# EasyEDA schematic sch_microcontroller.json
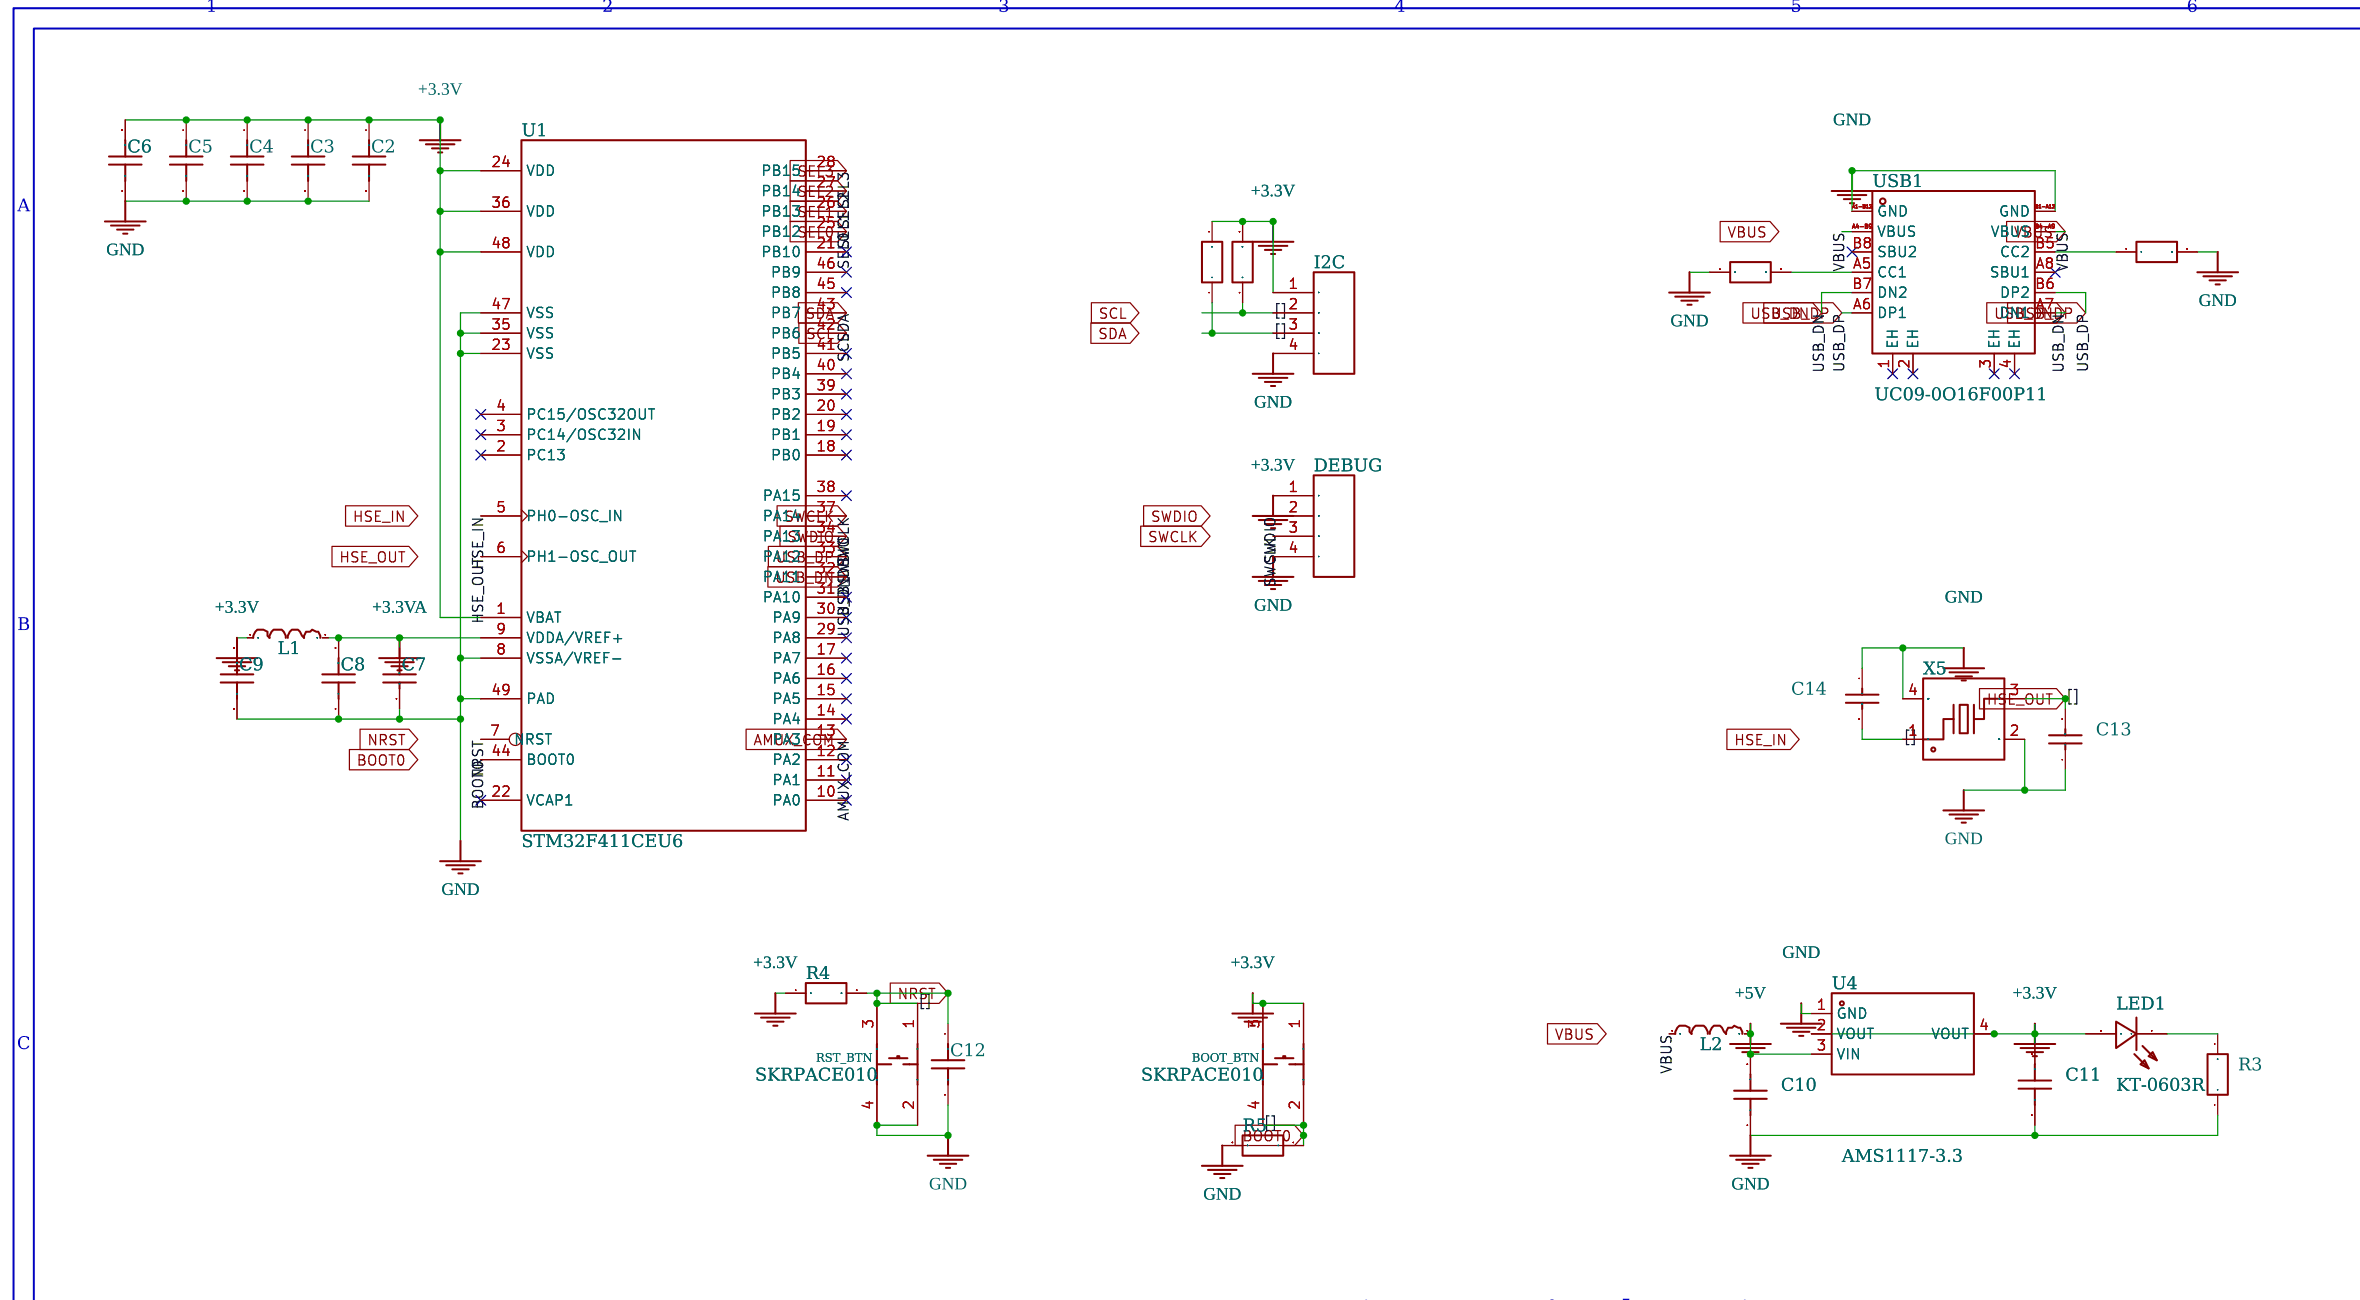
[diagram p0: schematic sheet]

## Parts
BOOT_BTN  SKRPACE010  [KEY-SMD_4P-L4.2-W3.2-P2.20-LS4.6]
C2  100nF  [C0201]
C3  100nF  [C0201]
C4  100nF  [C0201]
C5  100nF  [C0201]
C6  10uF  [C1206]
C7  10nF  [C0402]
C8  1uF  [C0402]
C9  1uF  [C0402]
C10  22uF  [C1206]
C11  22uF  [C1206]
C12  100nF  [C0201]
C13  20pF  [C0402]
C14  20pF  [C0402]
DEBUG  NO  [4 PIN HEADER]
I2C  NO  [4 PIN HEADER]
L1  BLM18AG121SN1D  [L0603]
L2  BLM18AG121SN1D  [L0603]
LED1  KT-0603R  [LED0603-RD]
R1  5.1kΩ  [R0402]
R2  5.1kΩ  [R0402]
R3  5.1kΩ  [R0402]
R4  10kΩ  [R0805]
R5  10kΩ  [R0805]
R6  1.2kΩ  [R0201]
R7  1.2kΩ  [R0201]
RST_BTN  SKRPACE010  [KEY-SMD_4P-L4.2-W3.2-P2.20-LS4.6]
U1  STM32F411CEU6  [UFQFPN-48_L7.0-W7.0-P0.50-BL-EP]
U4  AMS1117-3.3  [SOT-223-3_L6.5-W3.4-P2.30-LS7.0-BR]
USB1  UC09-0O16F00P11  [USB-C-SMD_UC09-0O16F00P11]
X5  25MHz  [CRYSTAL-SMD_4P-L3.2-W2.5-BL]

## Library data of the parts
BOOT_BTN RST_BTN = -: Supplier: LCSC; Manufacturer: ALPSALPINE(阿尔卑斯阿尔派); Supplier Part: C139797; JLCPCB Part Class: Extended Part; LCSC Part Name: 4.2*3.2*2.5mm 立贴 轻触开关; Supplier Footprint: SMD; Datasheet: https://atta.szlcsc.com/upload/public/pdf/source/20171113/C139797_15105612676371115729.pdf; Add into BOM: yes; Convert to PCB: yes; Circuit: SPST; Actuator Style: Oval button; Mounting Style: Brick nogging; Switch Length: 4.2mm; Switch Width: 3.2mm; Switch Height: 2.5mm; Contact Current: 50mA; Voltage Rating (DC): 16V
C2-C5 C12 = -: Symbol: TCC0201X7R104K160ZT; Device: TCC0201X7R104K160ZT; LCSC Part Name: 100nF ±10% 16V; Supplier Part: C18164586; Manufacturer: CCTC(三环); Manufacturer Part: TCC0201X7R104K160ZT; Supplier Footprint: 0201; JLCPCB Part Class: Extended Part; Datasheet: https://atta.szlcsc.com/upload/public/pdf/source/20191203/C466239_F62A586702D44EEA1C39B32FC8662B21.pdf; Supplier: LCSC; Add into BOM: yes; Convert to PCB: yes; Tolerance: ±10%; Voltage Rating: 16V; Temperature Coefficient: X7R
C6 = -: Symbol: HGC1206R7106K350NSPJ; Device: HGC1206R7106K350NSPJ; LCSC Part Name: 10uF ±10% 35V; Supplier Part: C33546014; Manufacturer: Chinocera(华瓷); Manufacturer Part: HGC1206R7106K350NSPJ; Supplier Footprint: 1206; JLCPCB Part Class: Extended Part; Datasheet: https://atta.szlcsc.com/upload/public/pdf/source/20240724/7749F3690BCC21BF5565A9D339ADF00C.pdf; Supplier: LCSC; Add into BOM: yes; Convert to PCB: yes; Tolerance: ±10%; Voltage Rating: 35V; Temperature Coefficient: X7R
C7 = -: Symbol: 0402B103K500NT; Device: 0402B103K500NT; LCSC Part Name: 10nF ±10% 50V; Supplier Part: C1524; Manufacturer: FH(风华); Manufacturer Part: 0402B103K500NT; Supplier Footprint: 0402; JLCPCB Part Class: Extended Part; Datasheet: https://atta.szlcsc.com/upload/public/pdf/source/20200305/C486355_26A10D38EF8C2A5C37091D0039909270.pdf; Supplier: LCSC; Add into BOM: yes; Convert to PCB: yes; Tolerance: ±10%; Voltage Rating: 50V; Temperature Coefficient: X7R
C8 C9 = -: Symbol: TCC0402X5R105K500AT; Device: TCC0402X5R105K500AT; LCSC Part Name: 1uF ±10% 50V; Supplier Part: C20539426; Manufacturer: CCTC(三环); Manufacturer Part: TCC0402X5R105K500AT; Supplier Footprint: 0402; JLCPCB Part Class: Extended Part; Datasheet: https://atta.szlcsc.com/upload/public/pdf/source/20191203/C466239_F62A586702D44EEA1C39B32FC8662B21.pdf; Supplier: LCSC; Add into BOM: yes; Convert to PCB: yes; Tolerance: ±10%; Voltage Rating: 50V; Temperature Coefficient: X5R
C10 C11 = -: Symbol: TCC1206X7R226K160HT; Device: TCC1206X7R226K160HT; LCSC Part Name: 22uF ±10% 16V; Supplier Part: C22392398; Manufacturer: CCTC(三环); Manufacturer Part: TCC1206X7R226K160HT; Supplier Footprint: 1206; JLCPCB Part Class: Extended Part; Datasheet: https://atta.szlcsc.com/upload/public/pdf/source/20191203/C466239_F62A586702D44EEA1C39B32FC8662B21.pdf; Supplier: LCSC; Add into BOM: yes; Convert to PCB: yes; Tolerance: ±10%; Voltage Rating: 16V; Temperature Coefficient: X7R
C13 C14 = -: Symbol: 0402CG200J500NT; Device: 0402CG200J500NT; LCSC Part Name: 20pF ±5% 50V; Supplier Part: C1554; Manufacturer: FH(风华); Manufacturer Part: 0402CG200J500NT; Supplier Footprint: 0402; JLCPCB Part Class: Basic Part; Datasheet: https://atta.szlcsc.com/upload/public/pdf/source/20200305/C486355_26A10D38EF8C2A5C37091D0039909270.pdf; Supplier: LCSC; Add into BOM: yes; Convert to PCB: yes; Tolerance: ±5%
DEBUG I2C = -: Symbol: 4 Pin Header; Device: 4 Pin Header; Add into BOM: no; Convert to PCB: yes
L1 L2 = -: LCSC Part Name: 单路 0603磁珠 阻抗120Ω@100MHz; Supplier Part: C76892; Manufacturer: muRata(村田); Supplier Footprint: 0603; JLCPCB Part Class: Extended Part; Datasheet: https://atta.szlcsc.com/upload/public/pdf/source/20180329/C160981_FD3C2D2622A377E203B89F4AA32B0741.pdf; Supplier: LCSC; Add into BOM: yes; Convert to PCB: yes; Impedance @ Frequency: 120Ω@100MHz; Tolerance: ±25%; DC Resistance: 180mΩ; Current Rating: 800mA; Circuits: 1
LED1 = -: LCSC Part Name: 0603 红灯 高亮; Supplier Part: C2286; Manufacturer: KENTO; Supplier Footprint: 0603; JLCPCB Part Class: Basic Part; Datasheet: https://atta.szlcsc.com/upload/public/pdf/source/20160616/1466072038404.pdf; Supplier: LCSC; Add into BOM: yes; Convert to PCB: yes; Emitted Color: Red; Operating Temperature: -40℃+85℃
R1-R3 = -: Symbol: FRC0402J512 TS; Device: FRC0402J512 TS; LCSC Part Name: 5.1kΩ ±5% 62.5mW 厚膜电阻; Supplier Part: C2906948; Manufacturer: FOJAN(富捷); Manufacturer Part: FRC0402J512 TS; Supplier Footprint: 0402; JLCPCB Part Class: Extended Part; Datasheet: https://atta.szlcsc.com/upload/public/pdf/source/20211221/925EC7D7225764EE0046F22065062C87.pdf; Supplier: LCSC; Add into BOM: yes; Convert to PCB: yes; Type: Thick Film Resistors; Tolerance: ±5%; Power(Watts): 1/16W; Voltage-Supply(Max): 50V; Temperature Coefficient: ±100ppm/℃; Operating Temperature: -55℃+155℃
R4 R5 = -: Symbol: HOAR0805-1/8W-10KR-1%-TCR25; Device: HoAR0805-1/8W-10KR-1%-TCR25; LCSC Part Name: 陶瓷电阻 10kΩ ±1% 125mW; Supplier Part: C5123591; Manufacturer: Milliohm(毫欧); Manufacturer Part: HoAR0805-1/8W-10KR-1%-TCR25; Supplier Footprint: 0805; JLCPCB Part Class: Extended Part; Datasheet: https://atta.szlcsc.com/upload/public/pdf/source/20220805/6A845D963435C707E89C4EB374FF6A6C.pdf; Supplier: LCSC; Add into BOM: yes; Convert to PCB: yes; Type: Ceramic resistor; Tolerance: ±1%; Power(Watts): 1/8W; Temperature Coefficient: ±25ppm/℃
R6 R7 = -: Symbol: AC0201FR-071K2L; Device: AC0201FR-071K2L; LCSC Part Name: 厚膜电阻 1.2kΩ ±1% 50mW; Supplier Part: C226448; Manufacturer: YAGEO(国巨); Manufacturer Part: AC0201FR-071K2L; Supplier Footprint: 0201; JLCPCB Part Class: Extended Part; Datasheet: https://atta.szlcsc.com/upload/public/pdf/source/20211117/A6A0BDAE103E877571F8FBA448670DE2.pdf; Supplier: LCSC; Add into BOM: yes; Convert to PCB: yes; Type: Thick Film Resistors; Tolerance: ±1%; Power(Watts): 50mW; Voltage-Supply(Max): 25V; Temperature Coefficient: ±200ppm/℃; Operating Temperature: -55℃+155℃
U1 = -: LCSC Part Name: 带DSP和FPU的高性能基本型系列ARM Cortex-M4 MCU，具有512 KB Flash、100 MHz CPU和ART加速器; Supplier Part: C60420; Manufacturer: ST(意法半导体); Supplier Footprint: UFQFPN-48(7x7); JLCPCB Part Class: Extended Part; Datasheet: https://atta.szlcsc.com/upload/public/pdf/source/20151026/1457707507170.pdf; Supplier: LCSC; Add into BOM: yes; Convert to PCB: yes; CPU Core: ARM-M4; CPU Maximum Speed: 100MHz; Program Storage Size: 512KB; Program Memory Type: FLASH; Number of I/O: 36; ADC (Bit): 12bit; Low Voltage Detection Threshold: 1.7V3.6V
U4 = -: Device: AMS1117-3.3_C6186; LCSC Part Name: 输出3.3V 1A; Supplier Part: C6186; Manufacturer: AMS; Supplier Footprint: SOT-223; JLCPCB Part Class: Basic Part; Datasheet: https://atta.szlcsc.com/upload/public/pdf/source/20180727/C6186_7A095716F0823C02F1997A905E26C086.pdf; Supplier: LCSC; Add into BOM: yes; Convert to PCB: yes; Output Type: Fixed; Output Voltage: 3.3V; Output Current: 1A; Power Supply Rejection Ratio (PSRR): 72dB@(120Hz); Voltage Dropout: 1.3V@(800mA); Features: Overcurrent Protection(OCP)；热关断(TSD); Output Configuration: Positive electrode; Number of Outputs: 1
USB1 = -: LCSC Part Name: USB Type-C 母座 卧贴; Supplier Part: C36936541; Manufacturer: BXCONN(宝讯); Supplier Footprint: SMD; JLCPCB Part Class: Extended Part; Datasheet: https://atta.szlcsc.com/upload/public/pdf/source/20240731/591155F6664C57552DC307035301A7C8.pdf; Supplier: LCSC; Add into BOM: yes; Convert to PCB: yes; Connector Type: Type-C; Gender: Female; Mounting Type: Horizontal attachment; Number of Contacts: 16P; Number of Ports: 1; Current Rating-Power: 3A
X5 = -: Symbol: S3225000271060C3; Device: S3225000271060C3; LCSC Part Name: 25MHz ±10ppm 27pF; Supplier Part: C5380610; Manufacturer: JGHC(晶光华); Manufacturer Part: S3225000271060C3; Supplier Footprint: SMD3225-4P; JLCPCB Part Class: Extended Part; Datasheet: https://atta.szlcsc.com/upload/public/pdf/source/20241029/60EE57D51513354C612A10EC3AE04C53.pdf; Supplier: LCSC; Add into BOM: yes; Convert to PCB: yes; Type: Surface Mount Crystal; Normal temperature Frequency Tolerance: ±10ppm; Load Capacitance: 27pF; Frequency Stability: ±30ppm; Equivalent Series Resistance(ESR): 60Ω; Operating Temperature: -40℃+85℃

## Nets
+3.3V: BOOT_BTN.1 BOOT_BTN.3 C2.1 C3.1 C4.1 C5.1 C6.2 C9.2 C11.2 DEBUG.1 I2C.1 L1.1 LED1.2(A) R4.1 R6.2 R7.2 U1.1(VBAT) U1.24(VDD) U1.36(VDD) U1.48(VDD) U4.2(VOUT) U4.4(VOUT)
+3.3VA: C7.2 C8.2 L1.2 U1.9(VDDA/VREF+)
+5V: C10.2 L2.2 U4.3(VIN)
GND: C2.2 C3.2 C4.2 C5.2 C6.1 C7.1 C8.1 C9.1 C10.1 C11.1 C12.2 C13.1 C14.1 DEBUG.4 I2C.4 R1.1 R2.2 R3.1 R5.2 RST_BTN.2 RST_BTN.4 U1.8(VSSA/VREF-) U1.23(VSS) U1.35(VSS) U1.47(VSS) U1.49(PAD) U4.1(GND) USB1.A1-B12(GND) USB1.B1-A12(GND) X5.2(GND) X5.4(GND)
VBUS: L2.1 USB1.A4-B9(VBUS) USB1.B4-A9(VBUS)
AMUX_COM: U1.13(PA3)
BOOT0: BOOT_BTN.2 BOOT_BTN.4 C12.1 C13.2 C14.2 I2C.2 I2C.3 R4.2 R5.1 R6.1 R7.1 RST_BTN.1 RST_BTN.3 U1.6(PH1-OSC_OUT) U1.7(NRST) U1.44(BOOT0) X5.1 X5.3
HSE_IN: U1.5(PH0-OSC_IN)
SCL: U1.42(PB6)
SDA: U1.43(PB7)
SEL0: U1.25(PB12)
SEL1: U1.26(PB13)
SEL2: U1.27(PB14)
SEL3: U1.28(PB15)
SWCLK: DEBUG.3 U1.37(PA14)
SWDIO: DEBUG.2 U1.34(PA13)
USB_DN: U1.32(PA11) USB1.A7(DN1) USB1.B7(DN2)
USB_DP: U1.33(PA12) USB1.A6(DP1) USB1.B6(DP2)
Net-(LED1-1): LED1.1(K) R3.2
Net-(R1-2): R1.2 USB1.A5(CC1)
Net-(R2-1): R2.1 USB1.B5(CC2)

Not connected (* = marked no-connect by the designer): U1 2(PC13)* 3(PC14/OSC32IN)* 4(PC15/OSC32OUT)* 10(PA0)* 11(PA1)* 12(PA2)* 14(PA4)* 15(PA5)* 16(PA6)* 17(PA7)* 18(PB0)* 19(PB1)* 20(PB2)* 21(PB10)* 22(VCAP1)* 29(PA8)* 30(PA9)* 31(PA10)* 38(PA15)* 39(PB3)* 40(PB4)* 41(PB5)* 45(PB8)* 46(PB9)*; USB1 1(EH)* 2(EH)* 3(EH)* 4(EH)* A8(SBU1)* B8(SBU2)*

## Notes on the sheet
- 1
- 2
- 3
- 4
- 5
- 6
- A
- A
- B
- B
- C
- C
- testing_stage1_schematic
- Create at
- 2025-03-28
- Schematic
- Update at
- 2025-04-01
- testing_stage1
- Board
- Page
- microcontroller
- Drawn
- macropad-final
- D
- Reviewed
- D
- Version
- Size
- Page  1  Total  2
- V1.0
- A4
- EasyEDA.com
- 1
- 2
- 3
- 4
- 5
- 6
